# EAGLE design gas_sensor (EAGLE 7.7.0)
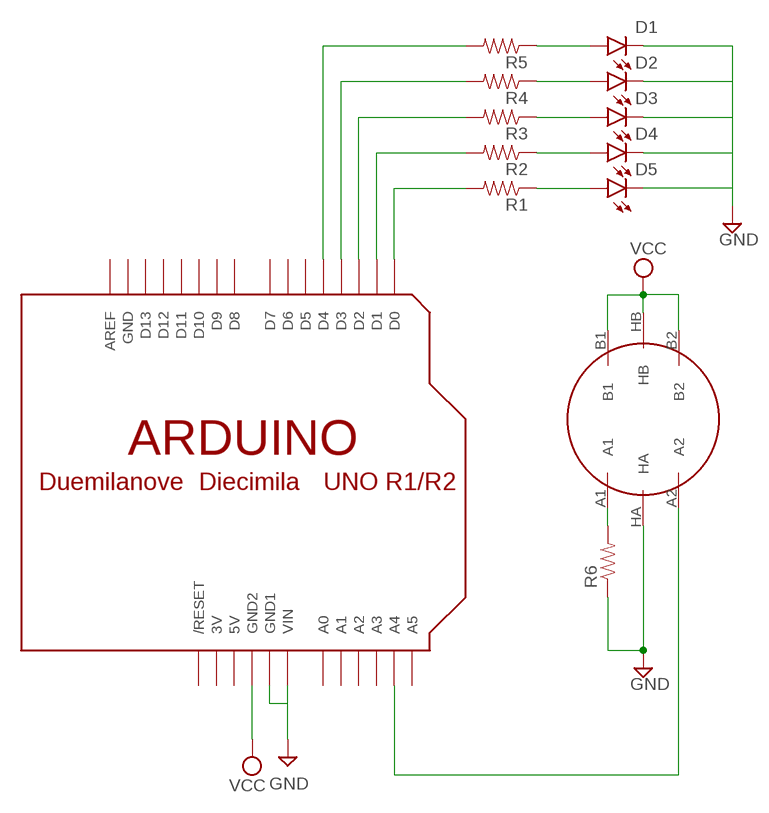
[diagram p0: schematic, sheet 1]

## Parts
D1  LED3MM  [LED3MM]
D2  LED3MM  [LED3MM]
D3  LED3MM  [LED3MM]
D4  LED3MM  [LED3MM]
D5  LED3MM  [LED3MM]
R1  RESISTORAXIAL-0.3  [AXIAL-0.3]
R2  RESISTORAXIAL-0.3  [AXIAL-0.3]
R3  RESISTORAXIAL-0.3  [AXIAL-0.3]
R4  RESISTORAXIAL-0.3  [AXIAL-0.3]
R5  RESISTORAXIAL-0.3  [AXIAL-0.3]
R6  RESISTORAXIAL-0.3  [AXIAL-0.3]
U$1  METHANE_SENSOR  [MQ-3]
U$2  ARDUINOUNO  [ARDUINO]

## Nets
GND: D1.K(C) D2.K(C) D3.K(C) D4.K(C) D5.K(C) R6.P$1 U$1.HA
N$1: U$1.A2
N$2: R5.P$2 U$2.D4
N$3: R4.P$2 U$2.D3
N$4: R3.P$2 U$2.D2
N$5: R2.P$2 U$2.D1
N$6: R1.P$2 U$2.D0
N$7: D1.A R5.P$1
N$8: D2.A R4.P$1
N$9: D3.A R3.P$1
N$10: D4.A R2.P$1
N$11: D5.A R1.P$1
N$12: R6.P$2 U$1.A1
VCC: U$1.B1 U$1.B2 U$1.HB
Unconnected: U$2.A0 U$2.A1 U$2.A2 U$2.A3 U$2.A4 U$2.A5 U$2.AREF U$2.D5 U$2.D6 U$2.D7 U$2.D8 U$2.D9 U$2.D10 U$2.D11 U$2.D12 U$2.D13 U$2.RESET(/RESET)

## Power pins joined to a net without a drawn wire
3V: U$2.3V
5V: U$2.5V
GND: U$2.GND
GND1: U$2.GND1
GND2: U$2.GND2
VIN: U$2.VIN

## Library data of the parts
D1-D5 = SparkFun-LED:LED: LEDs Standard schematic elements and footprints for 5mm, 3mm, 1206, and 0603 sized LEDs. 5mm - Spark Fun Electronics SKU : COM-00529 (and others); PROD_ID: DIO-08794
R1-R6 = SparkFun-Passives:RESISTOR: Resistor Basic schematic elements and footprints for 0603, 1206, and PTH resistors.
U$1 = SparkFun-Sensors:METHANE_SENSOR: MQ-4 Methane Gas Sensor SEN-09404
U$2 = adafruit:ARDUINO: Arduino Diecimila/Duemilanove Make a shield with ease, this package has all the named pins as well as the two mounting drill holes and an outline of the USB and DC power connector. The outline is on the DIMENSION layer, so if your board house uses it they will cut the outline to match. http://www.ladyada.net/library/pcb/eaglelibrary.html

## Board
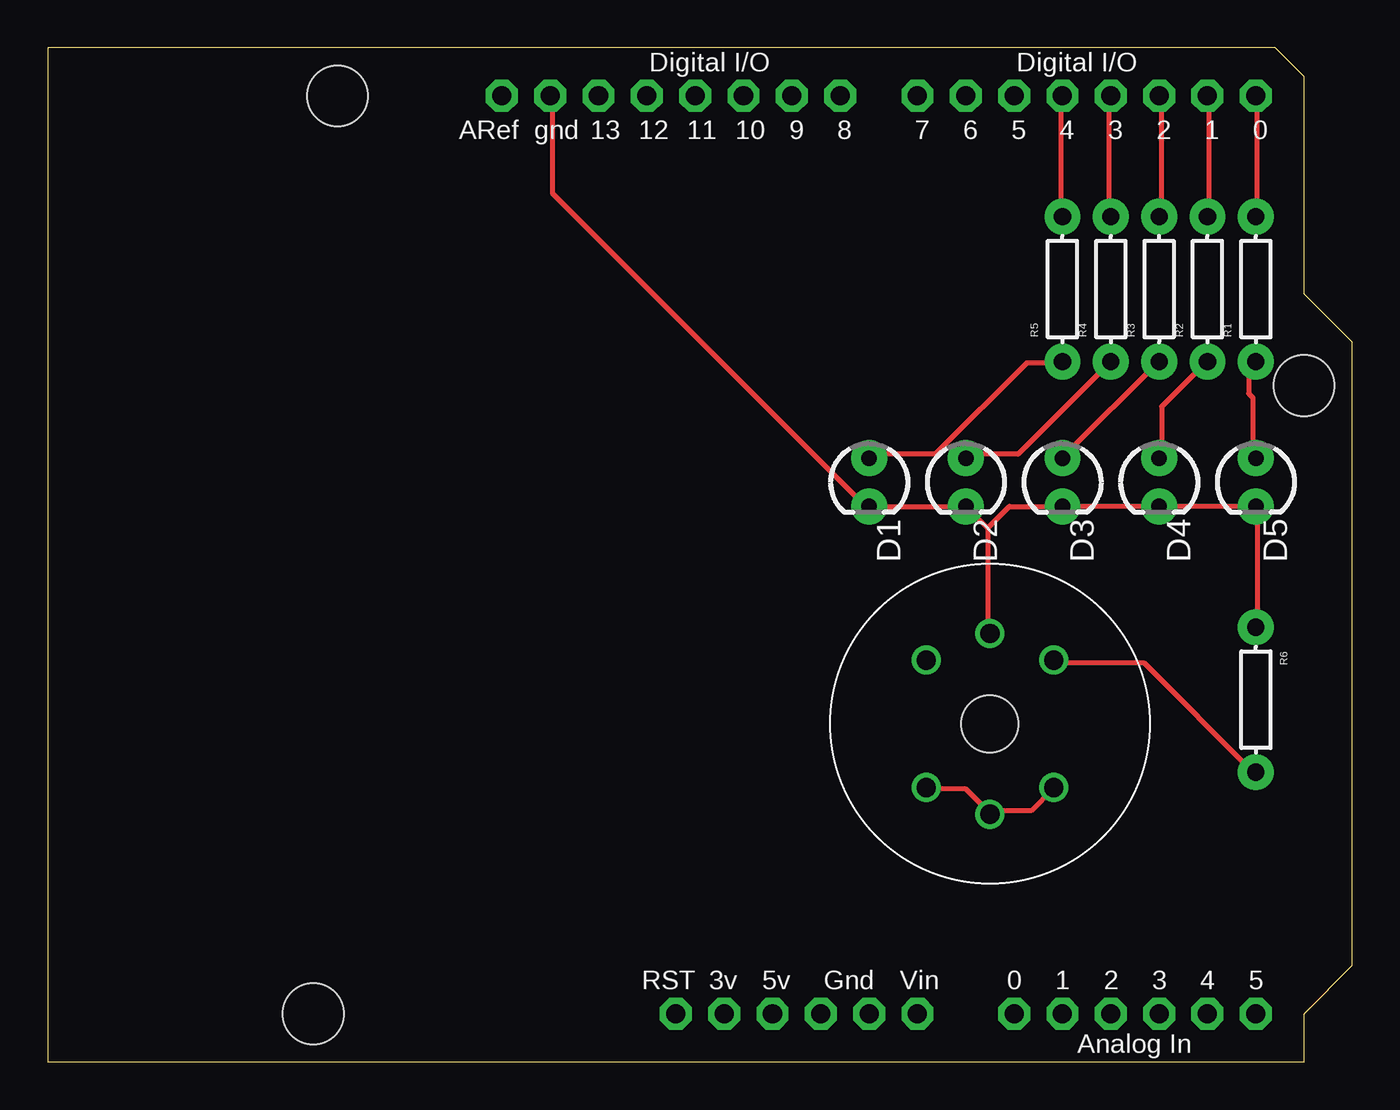
[diagram p1: board, top side]

Size 68.58 x 53.34 mm. Coordinates in mm from the lower left corner, seen from the top.
Copper layers (1*16): Top 0.035mm / dielectric 1.5mm / Bottom 0.035mm
Design rules "default": minimum track width 10mil, minimum drill 24mil, track to track 8mil, track to pad 8mil, pad to pad 8mil, via to via 8mil, smd to smd 8mil, copper to edge 40mil, drill to drill 8mil, minimum pad ring 10mil, minimum via ring 8mil, stop-mask expansion 4mil, vias tented up to drill 0mil, thermal gap 10mil

### Footprints (pad centres in the part's own frame; a part is rotated, then mirrored left to right if it is on the bottom)
LED3MM = drill 0.813 pad 1.88: A -1.27,0; K 1.27,0
AXIAL-0.3 = drill 0.9 pad 1.88: P$1 -3.81,0; P$2 3.81,0
MQ-3 = drill 1.016: A1 -3.35,3.35; A2 -3.35,-3.35; B1 3.35,3.35; B2 3.35,-3.35; HA -4.75,0; HB 4.75,0 | hole 3: 0,0
ARDUINO = drill 1 pad 1.676 octagon: 3V 35.56,2.54; 5V 38.1,2.54; A0 50.8,2.54; A1 53.34,2.54; A2 55.88,2.54; A3 58.42,2.54; A4 60.96,2.54; A5 63.5,2.54; AREF 23.876,50.8; D0 63.5,50.8; D1 60.96,50.8; D2 58.42,50.8; D3 55.88,50.8; D4 53.34,50.8; D5 50.8,50.8; D6 48.26,50.8; D7 45.72,50.8; D8 41.656,50.8; D9 39.116,50.8; D10 36.576,50.8; D11 34.036,50.8; D12 31.496,50.8; D13 28.956,50.8; GND 26.416,50.8; GND1 43.18,2.54; GND2 40.64,2.54; RESET 33.02,2.54; VIN 45.72,2.54 | hole 3.2: 15.24,50.8; 66.04,35.56; 13.97,2.54

### Placement (x,y rotation side)
D1  43.18,30.48 270 top
D2  48.26,30.48 270 top
D3  53.34,30.48 270 top
D4  58.42,30.48 270 top
D5  63.5,30.48 270 top
R1  63.5,40.64 90 top
R2  60.96,40.64 90 top
R3  58.42,40.64 90 top
R4  55.88,40.64 90 top
R5  53.34,40.64 90 top
R6  63.5,19.05 270 top
U$1  49.53,17.78 270 top
U$2  0,0 0 top

### Tracks (layer width: path | path; a pad name or v marks a point on that pad's centre or on a via)
GND
  Top 0.254: 49.4,28.07 49.4,22.58 U$1.HA | 49.4,28.07 D2.K D1.K 43,29.21 26.54,45.67 26.54,50.7 U$2.GND | 49.4,28.07 50.55,29.21 D3.K D4.K D5.K 63.58,29.21 63.58,23.04 R6.P$1
N$2
  Top 0.254: U$2.D4 53.29,50.7 53.29,44.53 R5.P$2
N$3
  Top 0.254: U$2.D3 55.8,50.7 55.8,44.53 R4.P$2
N$4
  Top 0.254: U$2.D2 58.55,50.7 58.55,44.53 R3.P$2
N$5
  Top 0.254: U$2.D1 61.06,50.7 61.06,44.53 R2.P$2
N$6
  Top 0.254: U$2.D0 63.58,50.7 63.58,44.53 R1.P$2
N$7
  Top 0.254: D1.A 43.23,31.95 46.66,31.95 51.46,36.75 53.29,36.75 R5.P$1
N$8
  Top 0.254: R4.P$1 51,31.95 48.26,31.95 D2.A
N$9
  Top 0.254: D3.A 53.52,31.95 58.32,36.75 R3.P$1
N$10
  Top 0.254: D4.A 58.55,31.95 58.55,34.47 60.83,36.75 R2.P$1
N$11
  Top 0.254: D5.A 63.35,31.95 63.35,34.93 63.12,35.15 63.12,36.52 63.35,36.75 R1.P$1
N$12
  Top 0.254: U$1.A1 53.06,20.98 57.63,20.98 63.35,15.26 R6.P$2
VCC
  Top 0.254: U$1.B1 52.83,14.35 51.69,13.21 49.63,13.21 U$1.HB 49.4,13.21 48.26,14.35 46.2,14.35 U$1.B2